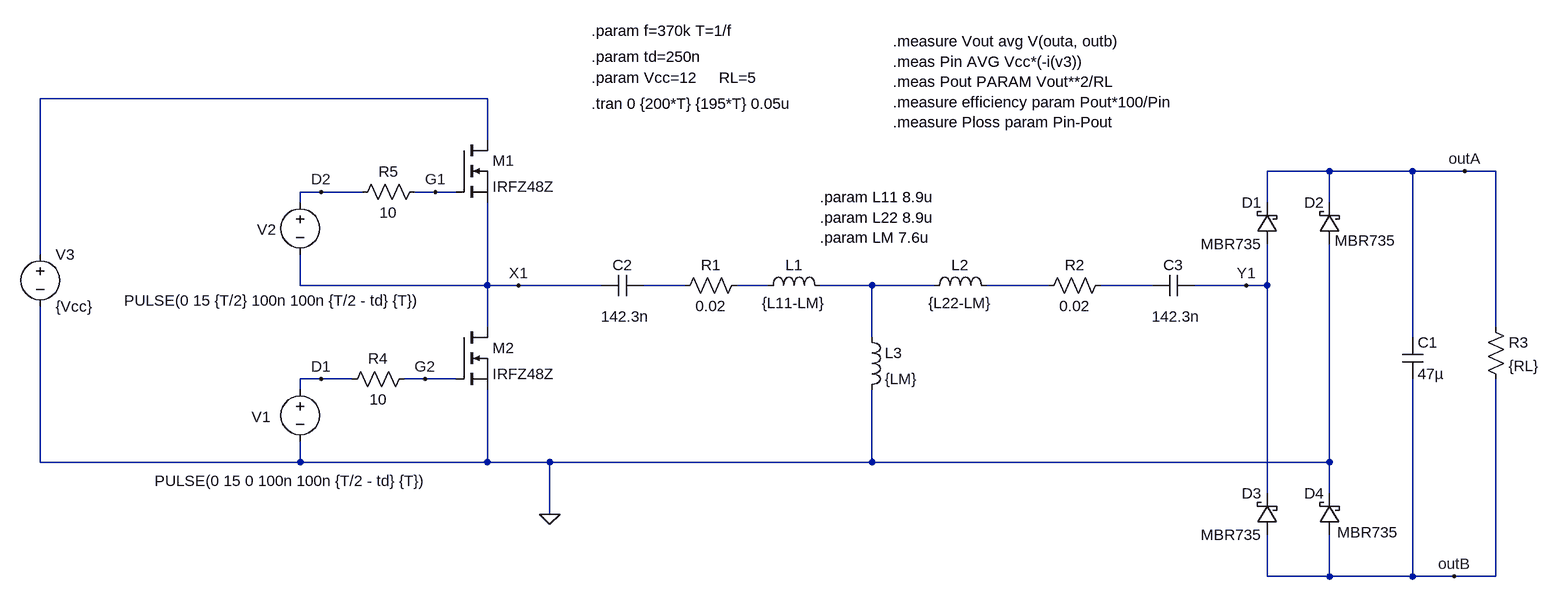
[diagram p0: schematic resonant-PI - half-bridge - 1.asc]
resonant-PI - half-bridge - 1.asc, the LTspice schematic file:
Version 4
SHEET 1 968 792
WIRE -960 -224 -1648 -224
WIRE -960 -160 -960 -224
WIRE 336 -112 240 -112
WIRE 464 -112 336 -112
WIRE 544 -112 464 -112
WIRE 592 -112 544 -112
WIRE -1216 -80 -1248 -80
WIRE -1152 -80 -1216 -80
WIRE -1040 -80 -1072 -80
WIRE -1008 -80 -1040 -80
WIRE -1248 -64 -1248 -80
WIRE 240 -64 240 -112
WIRE 336 -64 336 -112
WIRE -1648 16 -1648 -224
WIRE -1248 64 -1248 16
WIRE -960 64 -960 -64
WIRE -960 64 -1248 64
WIRE -912 64 -960 64
WIRE -784 64 -912 64
WIRE -656 64 -720 64
WIRE -528 64 -576 64
WIRE -368 64 -448 64
WIRE -272 64 -368 64
WIRE -96 64 -192 64
WIRE 64 64 -16 64
WIRE 208 64 128 64
WIRE 240 64 240 0
WIRE 240 64 208 64
WIRE -960 128 -960 64
WIRE 592 128 592 -112
WIRE -368 144 -368 64
WIRE 464 144 464 -112
WIRE -1216 208 -1248 208
WIRE -1168 208 -1216 208
WIRE -1056 208 -1088 208
WIRE -1008 208 -1056 208
WIRE -1248 224 -1248 208
WIRE -1648 336 -1648 96
WIRE -1248 336 -1248 304
WIRE -1248 336 -1648 336
WIRE -960 336 -960 224
WIRE -960 336 -1248 336
WIRE -864 336 -960 336
WIRE -368 336 -368 224
WIRE -368 336 -864 336
WIRE 336 336 336 0
WIRE 336 336 -368 336
WIRE 240 384 240 64
WIRE 336 384 336 336
WIRE -864 416 -864 336
WIRE 240 512 240 448
WIRE 336 512 336 448
WIRE 336 512 240 512
WIRE 464 512 464 208
WIRE 464 512 336 512
WIRE 528 512 464 512
WIRE 592 512 592 208
WIRE 592 512 528 512
FLAG 544 -112 outA
FLAG 528 512 outB
FLAG -1216 -80 D2
FLAG -1216 208 D1
FLAG -912 64 X1
FLAG -1040 -80 G1
FLAG -1056 208 G2
FLAG 208 64 Y1
FLAG -864 416 0
SYMBOL voltage -1248 208 R0
WINDOW 3 -224 157 Left 2
WINDOW 123 0 0 Left 2
WINDOW 39 0 0 Left 2
WINDOW 0 -75 58 Left 2
SYMATTR Value PULSE(0 15 0 100n 100n {T/2 - td} {T})
SYMATTR InstName V1
SYMBOL res -672 80 R270
WINDOW 0 32 56 VTop 2
WINDOW 3 0 56 VBottom 2
SYMATTR InstName R1
SYMATTR Value 0.02
SYMBOL res -112 80 R270
WINDOW 0 32 56 VTop 2
WINDOW 3 0 56 VBottom 2
SYMATTR InstName R2
SYMATTR Value 0.02
SYMBOL schottky 256 0 R180
WINDOW 0 24 64 Left 2
WINDOW 3 24 0 Left 2
SYMATTR InstName D1
SYMATTR Value MBR735
SYMATTR Description Diode
SYMATTR Type diode
SYMBOL cap 448 144 R0
SYMATTR InstName C1
SYMATTR Value 47µ
SYMBOL res 576 112 R0
SYMATTR InstName R3
SYMATTR Value {RL}
SYMBOL schottky 352 0 R180
WINDOW 0 24 64 Left 2
WINDOW 3 -86 5 Left 2
SYMATTR InstName D2
SYMATTR Value MBR735
SYMATTR Description Diode
SYMATTR Type diode
SYMBOL schottky 256 448 R180
WINDOW 0 24 64 Left 2
WINDOW 3 24 0 Left 2
SYMATTR InstName D3
SYMATTR Value MBR735
SYMATTR Description Diode
SYMATTR Type diode
SYMBOL schottky 352 448 R180
WINDOW 0 24 64 Left 2
WINDOW 3 -90 4 Left 2
SYMATTR InstName D4
SYMATTR Value MBR735
SYMATTR Description Diode
SYMATTR Type diode
SYMBOL cap -720 48 R90
WINDOW 0 0 32 VBottom 2
WINDOW 3 48 28 VTop 2
SYMATTR InstName C2
SYMATTR Value 142.3n
SYMBOL nmos -1008 -160 R0
SYMATTR InstName M1
SYMATTR Value IRFZ48Z
SYMBOL nmos -1008 128 R0
SYMATTR InstName M2
SYMATTR Value IRFZ48Z
SYMBOL res -1184 224 R270
WINDOW 0 32 56 VTop 2
WINDOW 3 0 56 VBottom 2
SYMATTR InstName R4
SYMATTR Value 10
SYMBOL res -1168 -64 R270
WINDOW 0 32 56 VTop 2
WINDOW 3 0 56 VBottom 2
SYMATTR InstName R5
SYMATTR Value 10
SYMBOL voltage -1248 -80 R0
WINDOW 3 -271 167 Left 2
WINDOW 123 0 0 Left 2
WINDOW 39 0 0 Left 2
WINDOW 0 -66 58 Left 2
SYMATTR Value PULSE(0 15 {T/2} 100n 100n {T/2 - td} {T})
SYMATTR InstName V2
SYMBOL voltage -1648 0 R0
WINDOW 123 0 0 Left 2
WINDOW 39 0 0 Left 2
SYMATTR InstName V3
SYMATTR Value {Vcc}
SYMBOL ind -544 80 R270
WINDOW 0 32 56 VTop 2
WINDOW 3 5 56 VBottom 2
SYMATTR InstName L1
SYMATTR Value {L11-LM}
SYMBOL ind -288 80 R270
WINDOW 0 32 56 VTop 2
WINDOW 3 5 56 VBottom 2
SYMATTR InstName L2
SYMATTR Value {L22-LM}
SYMBOL ind -384 128 R0
SYMATTR InstName L3
SYMATTR Value {LM}
SYMBOL cap 128 48 R90
WINDOW 0 0 32 VBottom 2
WINDOW 3 48 28 VTop 2
SYMATTR InstName C3
SYMATTR Value 142.3n
TEXT -800 -216 Left 2 !.tran 0 {200*T} {195*T} 0.05u
TEXT -448 -72 Left 2 !.param L11 8.9u\n.param L22 8.9u\n.param LM 7.6u
TEXT -800 -328 Left 2 !.param f=370k T=1/f
TEXT -800 -288 Left 2 !.param td=250n
TEXT -336 -312 Left 2 !.measure Vout avg V(outa, outb)\n.meas Pin AVG Vcc*(-i(v3))\n.meas Pout PARAM Vout**2/RL\n.measure efficiency param Pout*100/Pin\n.measure Ploss param Pin-Pout
TEXT -800 -256 Left 2 !.param Vcc=12     RL=5

The netlist it stands for:
* resonant-PI - half-bridge - 1.asc
V1 D1 0 PULSE(0 15 0 100n 100n {T/2 - td} {T})
R1 N002 N003 0.02
R2 N005 N006 0.02
D1 Y1 outA MBR735
C1 outA outB 47µ
R3 outA outB {RL}
D2 0 outA MBR735
D3 outB Y1 MBR735
D4 outB 0 MBR735
C2 N002 X1 142.3n
M1 N001 G1 X1 X1 IRFZ48Z
M2 X1 G2 0 0 IRFZ48Z
R4 D1 G2 10
R5 D2 G1 10
V2 D2 X1 PULSE(0 15 {T/2} 100n 100n {T/2 - td} {T})
V3 N001 0 {Vcc}
L1 N003 N004 {L11-LM}
L2 N004 N005 {L22-LM}
L3 N004 0 {LM}
C3 Y1 N006 142.3n
.model D D
.lib standard.dio
.model NMOS NMOS
.model PMOS PMOS
.lib standard.mos
.tran 0 {200*T} {195*T} 0.05u
.param L11 8.9u
.param L22 8.9u
.param LM 7.6u
.param f=370k T=1/f
.param td=250n
.measure Vout avg V(outa, outb)
.meas Pin AVG Vcc*(-i(v3))
.meas Pout PARAM Vout**2/RL
.measure efficiency param Pout*100/Pin
.measure Ploss param Pin-Pout
.param Vcc=12     RL=5
.backanno
.end